# Altium schematic sheet ESP32-HWE-Dev-Power.SchDoc
size A4; SheetNumber: 4; SheetTotal: 4
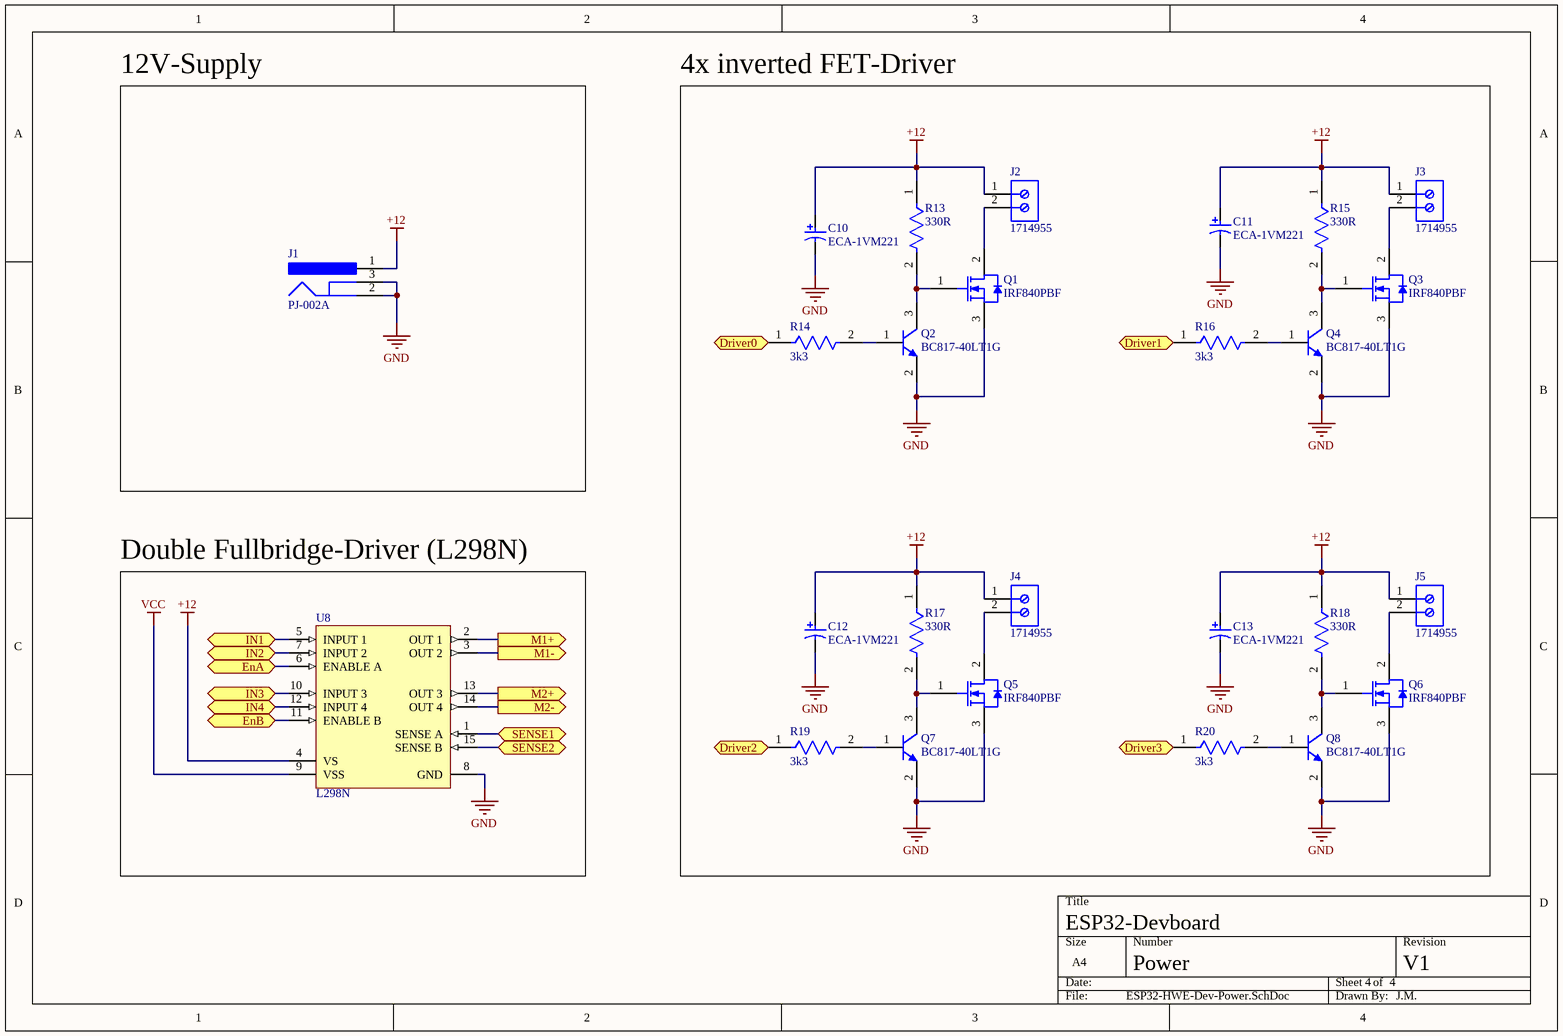
[diagram p0: ESP32-HWE-Dev-Power.SchDoc]

## Parts
C10  ECA-1VM221  [PNSC-ECA-1VM221-2]
C11  ECA-1VM221  [PNSC-ECA-1VM221-2]
C12  ECA-1VM221  [PNSC-ECA-1VM221-2]
C13  ECA-1VM221  [PNSC-ECA-1VM221-2]
J1  PJ-002A  [CUI-PJ-002A_V]
J2  1714955  [PHOE-1714955_V]
J3  1714955  [PHOE-1714955_V]
J4  1714955  [PHOE-1714955_V]
J5  1714955  [PHOE-1714955_V]
Q1  IRF840PBF  [VISH-TO-220AB-3]
Q2  BC817-40LT1G  [ONSC-SOT-23-3-318-08_V]
Q3  IRF840PBF  [VISH-TO-220AB-3]
Q4  BC817-40LT1G  [ONSC-SOT-23-3-318-08_V]
Q5  IRF840PBF  [VISH-TO-220AB-3]
Q6  IRF840PBF  [VISH-TO-220AB-3]
Q7  BC817-40LT1G  [ONSC-SOT-23-3-318-08_V]
Q8  BC817-40LT1G  [ONSC-SOT-23-3-318-08_V]
R13  330R  [FP-AC0805-MFG]
R14  3k3  [FP-AC0805-MFG]
R15  330R  [FP-AC0805-MFG]
R16  3k3  [FP-AC0805-MFG]
R17  330R  [FP-AC0805-MFG]
R18  330R  [FP-AC0805-MFG]
R19  3k3  [FP-AC0805-MFG]
R20  3k3  [FP-AC0805-MFG]
U8  L298N  [STM-FM-15]

## Ports
Driver0 (bidir, see ESP32-HWE-Dev[4C]), Driver1 (bidir, see ESP32-HWE-Dev[4C]), Driver2 (bidir, see ESP32-HWE-Dev[4D]), Driver3 (bidir, see ESP32-HWE-Dev[4D]), EnA (bidir, see ESP32-HWE-Dev[3C]), EnB (bidir, see ESP32-HWE-Dev[3D]), IN1 (bidir, see ESP32-HWE-Dev[3C]), IN2 (bidir, see ESP32-HWE-Dev[3C]), IN3 (bidir, see ESP32-HWE-Dev[3C]), IN4 (bidir, see ESP32-HWE-Dev[3C]), M1+ (out, see ESP32-HWE-Dev[3C]), M1- (out, see ESP32-HWE-Dev[3C]), M2+ (out, see ESP32-HWE-Dev[3C]), M2- (out, see ESP32-HWE-Dev[3D]), SENSE1 (bidir, see ESP32-HWE-Dev[3C]), SENSE2 (bidir, see ESP32-HWE-Dev[3C])

## Nets
+12: C10.1 C11.1 C12.1 C13.1 J1.1 J2.1 J3.1 J4.1 J5.1 R13.1 R15.1 R17.1 R18.1 U8.4(VS)
GND: C10.2 C11.2 C12.2 C13.2 J1.2 J1.3 Q1.3(S) Q2.2(E) Q3.3(S) Q4.2(E) Q5.3(S) Q6.3(S) Q7.2(E) Q8.2(E) U8.8(GND)
VCC: U8.9(VSS)
Driver0: R14.1 ; port Driver0
Driver1: R16.1 ; port Driver1
Driver2: R19.1 ; port Driver2
Driver3: R20.1 ; port Driver3
EnA: U8.6(ENABLE_A) ; port EnA
EnB: U8.11(ENABLE_B) ; port EnB
IN1: U8.5(INPUT_1) ; port IN1
IN2: U8.7(INPUT_2) ; port IN2
IN3: U8.10(INPUT_3) ; port IN3
IN4: U8.12(INPUT_4) ; port IN4
M1+: U8.2(OUT_1) ; port M1+
M1-: U8.3(OUT_2) ; port M1-
M2+: U8.13(OUT_3) ; port M2+
M2-: U8.14(OUT_4) ; port M2-
SENSE1: U8.1(SENSE_A) ; port SENSE1
SENSE2: U8.15(SENSE_B) ; port SENSE2
NetJ2_2: J2.2 Q1.2(D)
NetJ3_2: J3.2 Q3.2(D)
NetJ4_2: J4.2 Q5.2(D)
NetJ5_2: J5.2 Q6.2(D)
NetQ1_1: Q1.1(G) Q2.3(C) R13.2
NetQ2_1: Q2.1(B) R14.2
NetQ3_1: Q3.1(G) Q4.3(C) R15.2
NetQ4_1: Q4.1(B) R16.2
NetQ5_1: Q5.1(G) Q7.3(C) R17.2
NetQ6_1: Q6.1(G) Q8.3(C) R18.2
NetQ7_1: Q7.1(B) R19.2
NetQ8_1: Q8.1(B) R20.2

## Notes on the sheet
- 12V-Supply
- 4x inverted FET-Driver
- Double Fullbridge-Driver (L298N)
- ESP32-Devboard
- Power
- 4
- V1
- J.M.

## Library data of the parts
C10-C13 = CMP-2000-05311-1: Aluminum Electrolytic Capacitor, 220 uF, +/- 20%, 35 V, -40 to 85 degC, 2-Pin THD, RoHS, Bulk; Manufacturer: Panasonic; Lifetime@Temperature: 2000Hrs@85degC; Rated Voltage: 35V; Ripple Current: 350mA; Type: Radial; Capacitance: 220µF; Package Reference: ECA-1VM221; Series: M; Operating Temp Range: -40to+85degC; Package Description: 2-Pin Axial Lead, Dia 8 mm, Body Length 12.5 mm; Datasheet Version: Mar-06; Datasheet URL: https://datasheet.ciiva.com/26341/441851-da-01-en-elko-eca1vm221-m-r-220myf-35v-85c-26341906.pdf; Operating Temp-Max: 85degC; Case Size/Dimension: Ø8x11.5mm; Manufacturer URL: http://www.panasonic.com/
J1 = CMP-2000-06895-2: Through Hole Right Angle DC Power Jack, 2.5 A, 2 mm Center Pin, 3 Position, -25 to 85 degC, RoHS, Bulk; Manufacturer: CUIInc.; Brand: CUI; Inside Contact Diameter: 2mm; Voltage Rating: 24V; Outside Contact Diameter: 6.5mm; Current Rating: 2.5A; Insulation Resistance: 50MOhms; Contact Gender: Male; Connector Type: DCPowerJack; Datasheet Version: Rev. 1.03, 04/2016; Housing Material: PolybutyleneTerephthalate(PBT); Operating Temperature Range: -25Cto+85C; Termination Style: ThroughHole; Product Category: DCPowerConnectors; Mounting Technology: ThroughHole; Mounting Style: ThroughHole; Factory Pack Quantity: 500; Contact Plating: Nickel; Package Reference: PJ-002A; Mounting Angle: Right; Package Description: 3-Pin Through Hole Device, Body 14.4 x 9 mm, Height 11 mm; Flammability Rating: UL94V-0; Manufacturer URL: http://www.cui.com/; Product: Jacks; Contact Material: Copper; Datasheet URL: http://www.cui.com/product/resource/pj-002a.pdf; RoHS: True
J2-J5 = CMP-2000-05797-1: PC Terminal Block, Pitch 6.35 mm, 1 x 2 Position, Height 21.5 mm, Tail Lenght 5.1 mm, RoHS, Bulk; Manufacturer: Phoenix Contact; Package Description: PC Terminal Block, Pitch 6.35 mm, 1 x 2 Position, Height 21.5 mm, Tail Lenght 5.1 mm; Datasheet URL: http://media.digikey.com/pdf/Data%20Sheets/Phoenix%20Contact%20PDFs/1714955.pdf; Package Reference: 1714955; Manufacturer URL: http://www.phoenixcontact.com/; Datasheet Version: 02/2010; Mounting Technology: ThroughHole
Q1 Q3 Q5 Q6 = CMP-2000-06467-1: Power MOSFET, 500 V, -55 to 150 degC, 3-Pin FM, RoHS, Tape and Reel; Manufacturer: Vishay; Maximum Gate Source Voltage: ±20V; Channel Mode: Enhancement; Typical Gate Charge @ Vgs: 63nC@10V; Number of Elements per Chip: 1; Typical Turn-On Delay Time: 14ns; Typical Input Capacitance @ Vds: 1300pF@25V; Maximum Continuous Drain Current: 8A; Maximum Drain Source Voltage: 500V; Minimum Gate Threshold Voltage: 2V; Typical Turn-Off Delay Time: 49ns; Maximum Drain Source Resistance: 0.85Ω; Maximum Power Dissipation: 125W; Channel Type: N; Mounting Type: ThroughHole; Datasheet URL: https://datasheet.ciiva.com/26791/irf840pbf-26791500.pdf; Package Type: TO-220AB; Dimensions: 10.41x4.7x9.01mm; Category: PowerMOSFET; Width: 4.7mm; Datasheet Version: Rev. C, 03/2011; Maximum Operating Temperature: +150°C; Manufacturer URL: http://www.vishay.com/; Package Description: 3-Pin Flange Mount, Body 10.275 x 4.45 mm, Pitch 2.54 mm; Length: 10.41mm; Height: 9.01mm; Mounting Technology: ThroughHole; Package Reference: TO-220AB-3; Pin Count: 3; Minimum Operating Temperature: -55°C; Package URL: http://www.vishay.com/docs/71195/to220ab.pdf
Q2 Q4 Q7 Q8 = CMP-1048-00019-1: General Purpose Transistor, NPN Silicon, 3-Pin SOT-23, Pb-Free, Tape and Reel; Manufacturer: On Semiconductor; fT Min (MHz): 100; IC Continuous (A): 0.5; ComponentLink2URL: http://www.onsemi.com/pub_link/Collateral/BC817-16LT1-D.PDF; DatasheetVersion: Rev. 12; ComponentLink3URL: http://www.onsemi.cn/pub_link/Collateral/318-08.PDF; ComponentLink3Description: Package Specification; ComponentLink1Description: Manufacturer URL; Mounting Technology: Surface Mount; ComponentLink1URL: http://www.onsemi.com/; Packing: Tape and Reel; ComponentLink2Description: Datasheet; Polarity: NPN; RoHS: TRUE; PackageVersion: Rev. AP, 11/2009; PartNumber: BC817-40LT1G; PackageDescription: 3-Pin Small Outline Transistor, Body 2.92 x 1.3 mm, Pitch 0.95 mm; PackageReference: SOT-23-3-318-08
R13-R20 = CMP-2001-04476-2: RES SMD 4.7K OHM 5% 1/8W 0805; Manufacturer: Yageo; Manufacturer Part Number: AC0805JR-074K7L; Tolerance: 0.05; Value: 4.7KΩ; Voltage Rating: 150V; Automotive Grade: Grade 0; ComponentLink2URL: http://www.yageo.com/documents/recent/PYu-AC_51_RoHS_L_6.pdf; Power Rating: 1/8W; Package: AC0805; Mouser Description: Thick Film Resistors - SMD 1/8W 4.7K ohm 5% AEC-Q200; Height: 0.6mm; Device Class L2: Resistors; ComponentLink2Description: Datasheet; Series: AC; RoHS: TRUE; Resistance: 4.7KΩ; Digikey Description: RES SMD 4.7K OHM 5% 1/8W 0805; Lead Free: Yes; Category: Res; Temperature Range Low: -55°C; Temperature Range High: +155°C; Composition: Thick Film; Device Class L3: Chip SMD Resistors; Device Class L1: Passive Components; Automotive: Yes; Octopart: https://octopart.com/ac0805jr-074k7l-yageo-26638632; Temperature: -55°C to +155°C; Ipc Land Pattern Name: RESC200125X50; Footprint Url: http://www.yageo.com/exep/pages/download/literatures/PYu-R_Mount_10.pdf
U8 = CMP-2000-06526-1: Dual Full-Bridge Driver, 4.8 to 46 V, -40 to 150 degC, 15-Pin FM (MW 15L), RoHS, Tube; Manufacturer: STMicroelectronics; PartNumber: L298; Output Current: 2A; Supply Voltage Max: 7V; Driver Case Style: Multiwatt; Supply Voltage Min: 4.5V; No. of Pins: 15Pins; SVHC: NoSVHC(17-Dec-2015); Output Voltage: 46V; No. of Outputs: 4Outputs; Motor Type: FullBridge; MSL: -; Package Description: 15-Pin Flange Mount, Body 5 x 19.6 mm, Pitch 1.27 mm; Datasheet Version: 01/2000; Package Reference: FM-15; Mounting Technology: ThroughHole; Packaging: Each; Automotive Qualification Standard: -; Product Range: -; Datasheet URL: https://datasheet.ciiva.com/15109/getdatasheetpartid-50682-15109332.pdf; Operating Temperature Max: 130°C; Operating Temperature Min: -25°C; Manufacturer URL: http://www.st.com/